# Altium schematic sheet Sheet2.SchDoc
size A
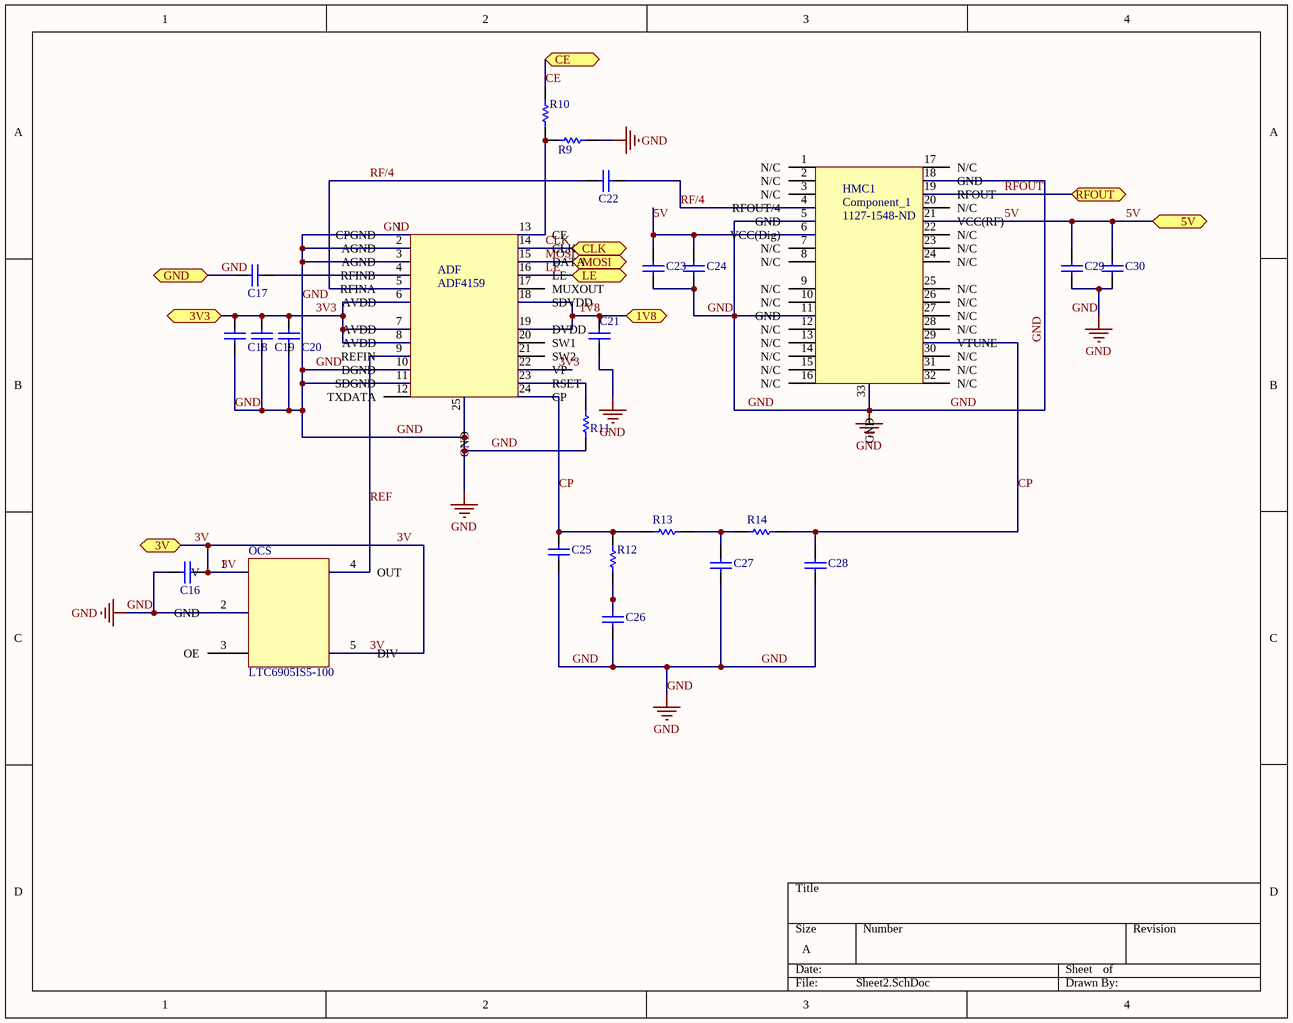
[diagram p0: Sheet2.SchDoc]

## Parts
ADF  ADF4159  [QFN50P400X400X80_HS-25N]
C16  CAP 0.1uF 16V 0603(1608)  [CAPC0603(1608)100_L]  (value not drawn)
C17  CAP 100pF 16V 0603(1608)  [CAPC0603(1608)100_L]  (value not drawn)
C18  CAP 10uF 16V 0603(1608)  [CAPC0603(1608)100_L]  (value not drawn)
C19  CAP 10uF 16V 0603(1608)  [CAPC0603(1608)100_L]  (value not drawn)
C20  CAP 10uF 16V 0603(1608)  [CAPC0603(1608)100_L]  (value not drawn)
C21  CAP 10uF 16V 0603(1608)  [CAPC0603(1608)100_L]  (value not drawn)
C22  CAP 1000pF 16V 0603(1608)  [CAPC0603(1608)100_L]  (value not drawn)
C23  CAP 2.2uF 16V 0603(1608)  [CAPC0603(1608)100_L]  (value not drawn)
C24  CAP 100pF 16V 0603(1608)  [CAPC0603(1608)100_L]  (value not drawn)
C25  CAP 360pF 16V 0603(1608)  [CAPC0603(1608)100_L]  (value not drawn)
C26  CAP 5.6nF 16V 0603(1608)  [CAPC0603(1608)100_L]  (value not drawn)
C27  CAP 270pF 16V 0603(1608)  [CAPC0603(1608)100_L]  (value not drawn)
C28  CAP 270pF 16V 0603(1608)  [CAPC0603(1608)100_L]  (value not drawn)
C29  CAP 2.2uF 16V 0603(1608)  [CAPC0603(1608)100_L]  (value not drawn)
C30  CAP 100pF 16V 0603(1608)  [CAPC0603(1608)100_L]  (value not drawn)
HMC1  Component_1  Supplier Part Number 1: 1127-1548-ND  [QFN50P500X500X100_HS-33N]
OCS  LTC6905IS5-100  [TSOP95P280X100-5N]
R9  120 1% 0603(1608)  [RESC0603(1608)_N]  (value not drawn)
R10  100 1% 0603(1608)  [RESC0603(1608)_N]  (value not drawn)
R11  5100 1% 0603(1608)  [RESC0603(1608)_N]  (value not drawn)
R12  330 1% 0603(1608)  [RESC0603(1608)_N]  (value not drawn)
R13  180 1% 0603(1608)  [RESC0603(1608)_N]  (value not drawn)
R14  180 1% 0603(1608)  [RESC0603(1608)_N]  (value not drawn)

## Ports
1V8, 3V, 3V3, 5V, CE, CLK, GND, LE, MOSI, RFOUT

## Nets
GND: ADF.1(CPGND) ADF.2(AGND) ADF.3(AGND) ADF.10(DGND) ADF.11(SDGND) ADF.25(GND) C16.2 C17.2 C18.2 C19.2 C20.2 C21.2 C23.1 C24.1 C25.2 C26.1 C27.1 C28.1 C29.1 C30.1 HMC1.5(GND) HMC1.11(GND) HMC1.18(GND) HMC1.33(GND) OCS.2(GND) R9.1 R11.2 ; port GND
1V8: ADF.18(SDVDD) ADF.19(DVDD) C21.1 ; port 1V8
3V: C16.1 OCS.1(V) OCS.5(DIV) ; port 3V
3V3: ADF.6(AVDD) ADF.7(AVDD) ADF.8(AVDD) ADF.22(VP) C18.1 C19.1 C20.1 ; port 3V3
5V: C23.2 C24.2 C29.2 C30.2 HMC1.6(VCC(Dig)) HMC1.21(VCC(RF)) ; port 5V
CE: R10.2 ; port CE
CLK: ADF.14(CLK) ; port CLK
CP: ADF.24(CP) C25.1 C28.2 HMC1.29(VTUNE) R12.2 R13.1 R14.2
LE: ADF.16(LE) ; port LE
MOSI: ADF.15(DATA) ; port MOSI
REF: ADF.9(REFIN) OCS.4(OUT)
RF/4: ADF.5(RFINA) C22.1 C22.2 HMC1.4(RFOUT/4)
RFOUT: HMC1.19(RFOUT) ; port RFOUT
NetADF_4: ADF.4(RFINB) C17.1
NetADF_13: ADF.13(CE) R9.2 R10.1
NetADF_23: ADF.23(RSET) R11.1
NetC26_2: C26.2 R12.1
NetC27_2: C27.2 R13.2 R14.1

Not connected (* = marked no-connect by the designer): ADF 12(TXDATA) 17(MUXOUT) 20(SW1) 21(SW2); HMC1 1(N/C) 2(N/C) 3(N/C) 7(N/C) 8(N/C) 9(N/C) 10(N/C) 12(N/C) 13(N/C) 14(N/C) 15(N/C) 16(N/C) 17(N/C) 20(N/C) 22(N/C) 23(N/C) 24(N/C) 25(N/C) 26(N/C) 27(N/C) 28(N/C) 30(N/C) 31(N/C) 32(N/C); OCS 3(OE)

## Notes on the sheet
- Labels drawn without touching a wire or pin: GND

## Library data of the parts
C16 = CMP-1035-01744-1: CAP 0.1uF 16V ±1% 0603 (1608 Metric) Thickness 1mm SMD; Tolerance: Â±1%; Case-Metric: 1608; Case-EIA: 0603; Technology: SMT; Max Thickness: 1 mm; Value: 0.1uF; Rated Voltage: 16 V
C17 C24 C30 = CMP-1035-01744-1: CAP 100pF 16V ±1% 0603 (1608 Metric) Thickness 1mm SMD; Tolerance: Â±1%; Case-Metric: 1608; Case-EIA: 0603; Technology: SMT; Max Thickness: 1 mm; Value: 100pF; Rated Voltage: 16 V
C18-C21 = CMP-1035-01744-1: CAP 10uF 16V ±1% 0603 (1608 Metric) Thickness 1mm SMD; Tolerance: Â±1%; Case-Metric: 1608; Case-EIA: 0603; Technology: SMT; Max Thickness: 1 mm; Value: 10uF; Rated Voltage: 16 V
C22 = CMP-1035-01744-1: CAP 1000pF 16V ±1% 0603 (1608 Metric) Thickness 1mm SMD; Tolerance: Â±1%; Case-Metric: 1608; Case-EIA: 0603; Technology: SMT; Max Thickness: 1 mm; Value: 1000pF; Rated Voltage: 16 V
C23 C29 = CMP-1035-01744-1: CAP 2.2uF 16V ±1% 0603 (1608 Metric) Thickness 1mm SMD; Tolerance: Â±1%; Case-Metric: 1608; Case-EIA: 0603; Technology: SMT; Max Thickness: 1 mm; Value: 2.2uF; Rated Voltage: 16 V
C25 = CMP-1035-01744-1: CAP 390pF 16V ±1% 0603 (1608 Metric) Thickness 1mm SMD; Tolerance: Â±1%; Case-Metric: 1608; Case-EIA: 0603; Technology: SMT; Max Thickness: 1 mm; Value: 390pF; Rated Voltage: 16 V
C26 = CMP-1035-01744-1: CAP 5.6nF 16V ±1% 0603 (1608 Metric) Thickness 1mm SMD; Tolerance: Â±1%; Case-Metric: 1608; Case-EIA: 0603; Technology: SMT; Max Thickness: 1 mm; Value: 5.6nF; Rated Voltage: 16 V
C27 C28 = CMP-1035-01744-1: CAP 270pF 16V ±1% 0603 (1608 Metric) Thickness 1mm SMD; Tolerance: Â±1%; Case-Metric: 1608; Case-EIA: 0603; Technology: SMT; Max Thickness: 1 mm; Value: 270pF; Rated Voltage: 16 V
HMC1 = Component_1: HMC735 IC Schematic; Supplier 1: Digi-Key
R9 = CMP-1012-00736-1: 120 0.1W 1% 0603 (1608 Metric)  SMD; Value: 120 Ohm; Case-Metric: 1608; Case-EIA: 0603; Power: 0.1 W; Tolerance: 1 %; Technology: SMT
R10 = CMP-1012-00736-1: 100 0.1W 1% 0603 (1608 Metric)  SMD; Value: 100 Ohm; Case-Metric: 1608; Case-EIA: 0603; Power: 0.1 W; Tolerance: 1 %; Technology: SMT
R11 = CMP-1012-00736-1: 5100 0.1W 1% 0603 (1608 Metric)  SMD; Value: 5100 Ohm; Case-Metric: 1608; Case-EIA: 0603; Power: 0.1 W; Tolerance: 1 %; Technology: SMT
R12 = CMP-1012-00736-1: 330 0.1W 1% 0603 (1608 Metric)  SMD; Value: 330 Ohm; Case-Metric: 1608; Case-EIA: 0603; Power: 0.1 W; Tolerance: 1 %; Technology: SMT
R13 R14 = CMP-1012-00736-1: 180 0.1W 1% 0603 (1608 Metric)  SMD; Value: 180 Ohm; Case-Metric: 1608; Case-EIA: 0603; Power: 0.1 W; Tolerance: 1 %; Technology: SMT